# EAGLE design pad3 (EAGLE 6.5.0)
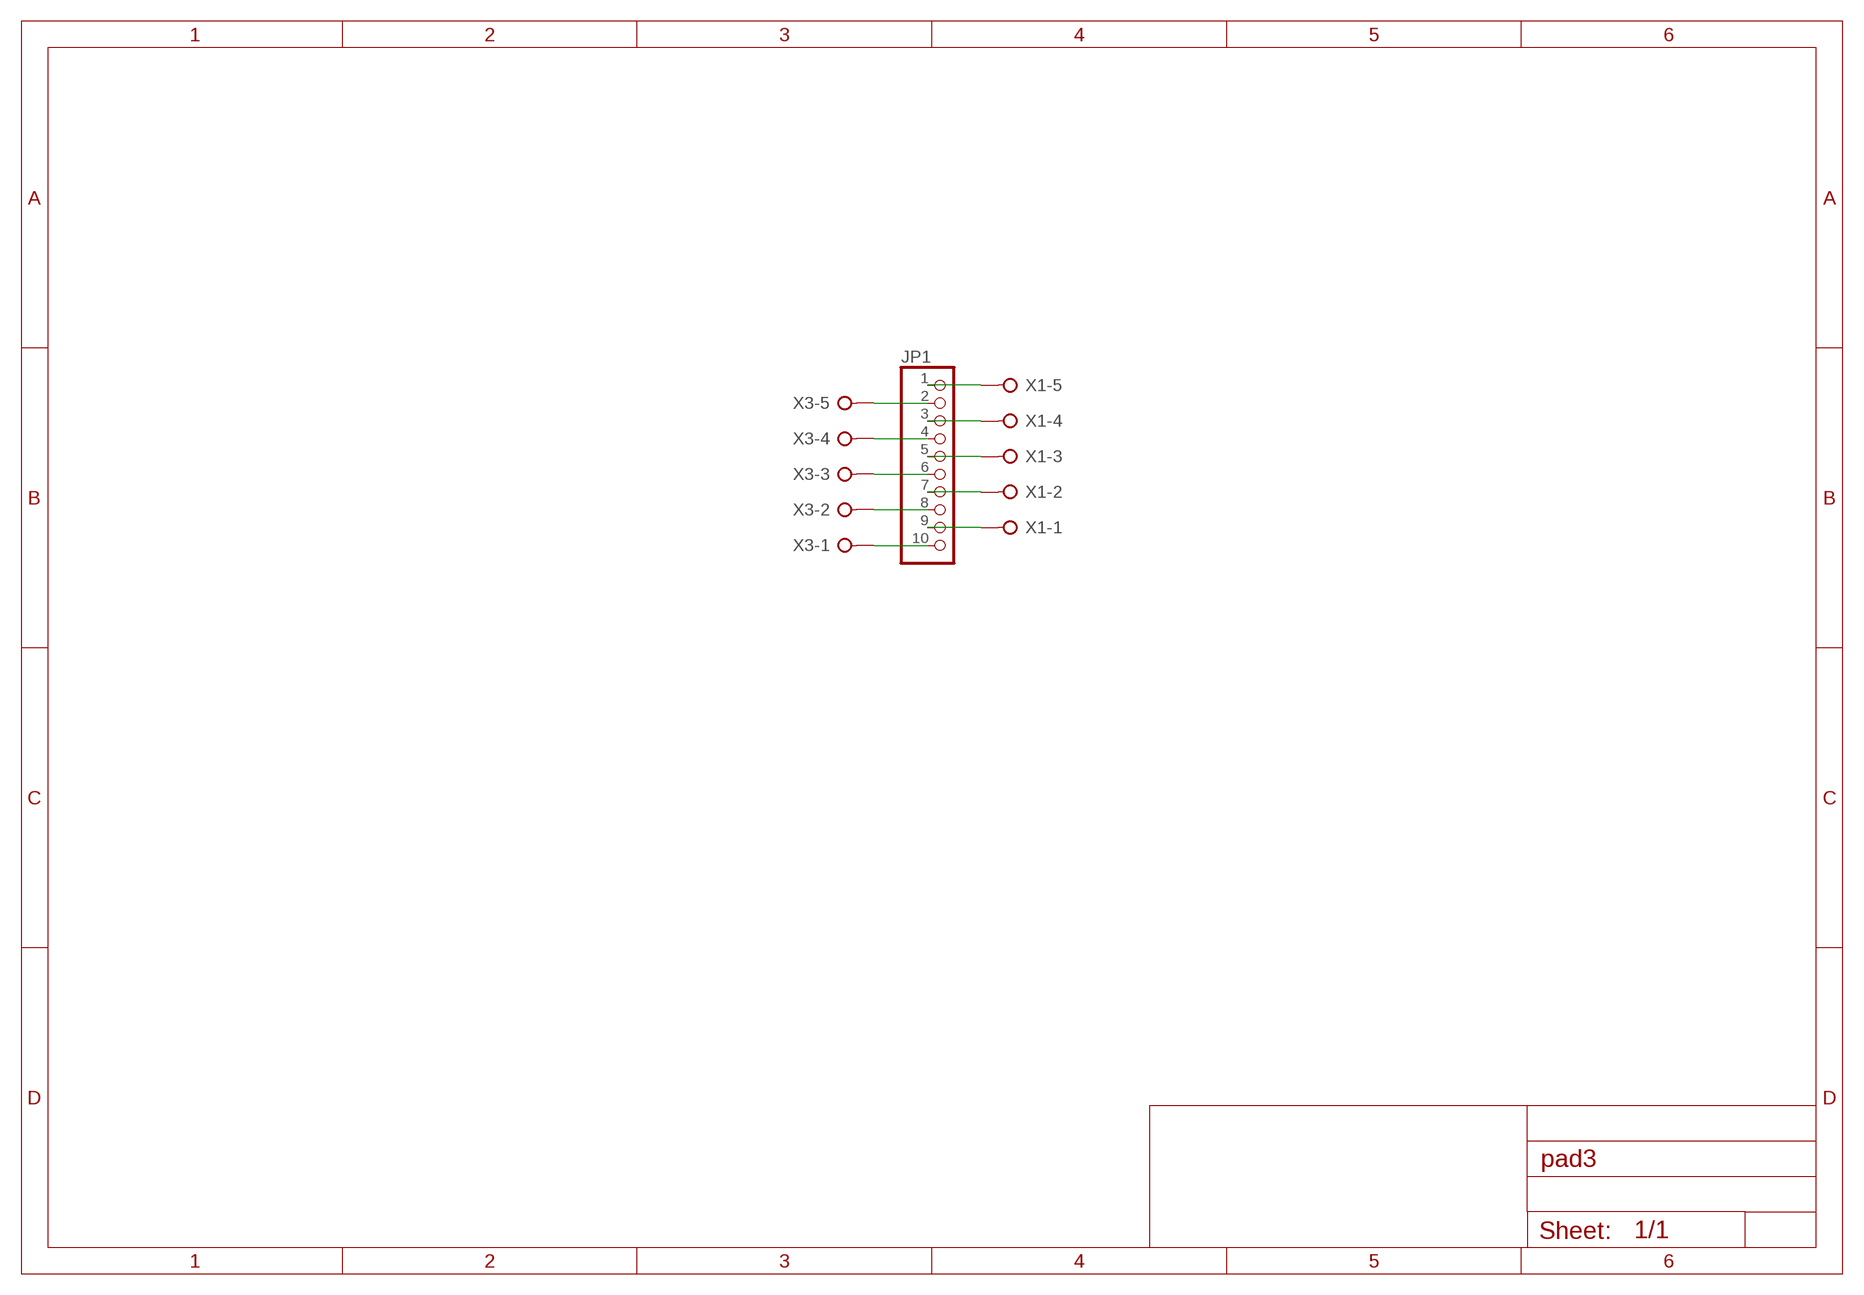
[diagram p0: schematic, sheet 1]

## Parts
JP1  PINHD-1X10  [1X10]
X1  W237-05P  [W237-5P]
X3  W237-05P  [W237-5P]

## Nets
N$1: JP1.9 X1.1
N$3: JP1.10 X3.1
N$5: JP1.8 X3.2
N$6: JP1.7 X1.2
N$7: JP1.6 X3.3
N$8: JP1.4 X3.4
N$9: JP1.5 X1.3
N$11: JP1.3 X1.4
N$12: JP1.2 X3.5
N$13: JP1.1 X1.5

## Library data of the parts
JP1 = pinhead:PINHD-1X10: PIN HEADER
X1 X3 = con-wago-508:W237-05P: WAGO SREW CLAMP; OC_FARNELL: unknown; OC_NEWARK: unknown

## Board
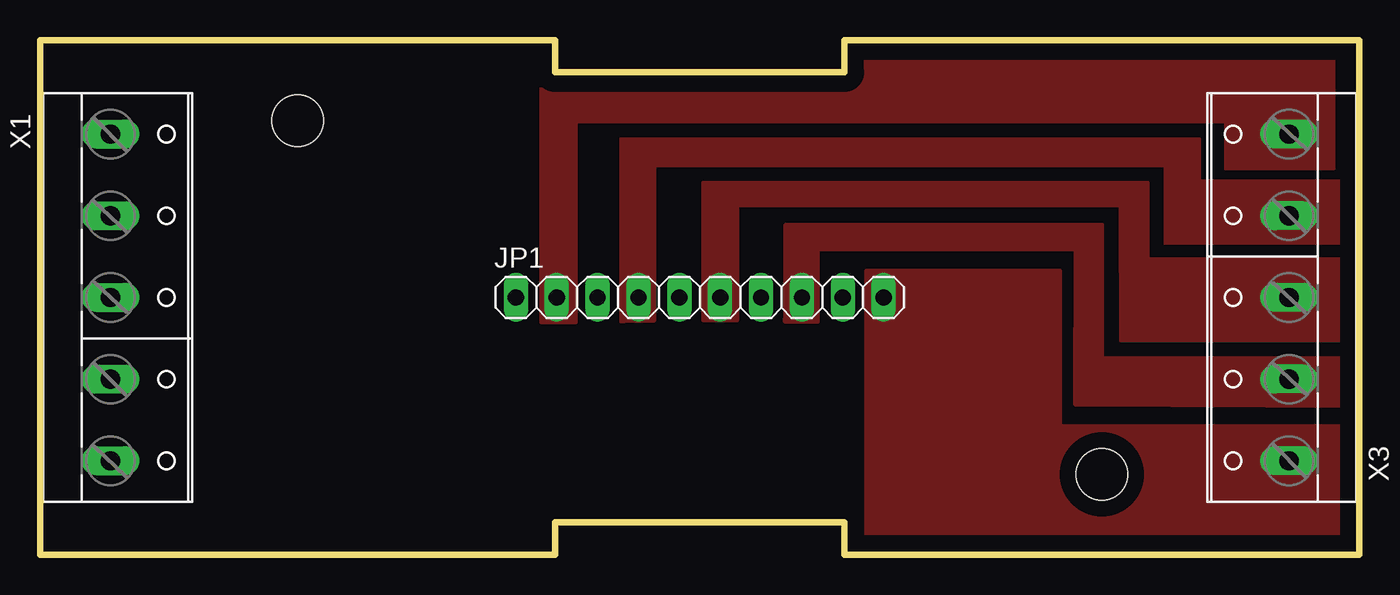
[diagram p1: board, top side]
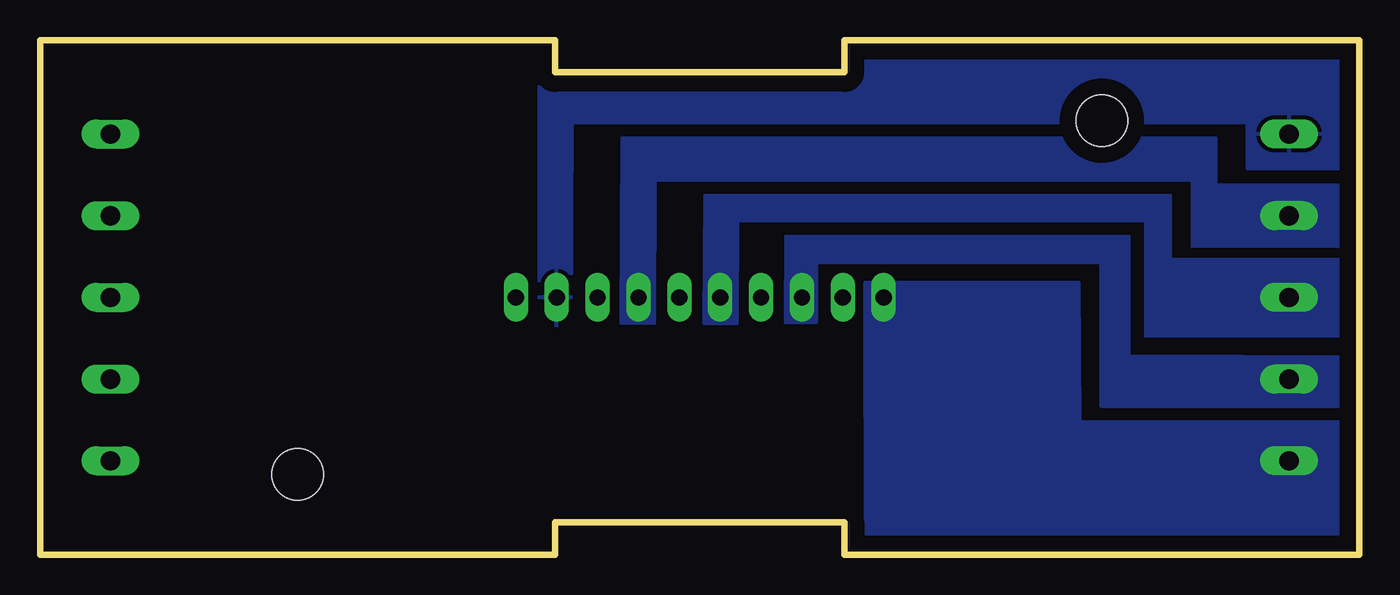
[diagram p2: board, bottom side, seen from below]

Size 82 x 32 mm. Coordinates in mm from the lower left corner, seen from the top.
Outline: 0,32 32,32 32,30 50,30 50,32 82,32 82,0 50,0 50,2 32,2 32,0 0,0 0,32
Copper layers (1*16): Top 0.035mm / dielectric 1.5mm / Bottom 0.035mm
Design rules "default": minimum track width 10mil, minimum drill 24mil, track to track 8mil, track to pad 8mil, pad to pad 8mil, via to via 8mil, smd to smd 8mil, copper to edge 40mil, drill to drill 8mil, minimum pad ring 10mil, minimum via ring 8mil, stop-mask expansion 4mil, vias tented up to drill 0mil, thermal gap 10mil
Holes 3.2 mm at 16,27 66,5

### Footprints (pad centres in the part's own frame; a part is rotated, then mirrored left to right if it is on the bottom)
1X10 = drill 1.016 long: 1 -11.43,0; 2 -8.89,0; 3 -6.35,0; 4 -3.81,0; 5 -1.27,0; 6 1.27,0; 7 3.81,0; 8 6.35,0; 9 8.89,0; 10 11.43,0
W237-5P = drill 1.194 long: 1 -10.16,-0.635; 2 -5.08,-0.635; 3 0,-0.635; 4 5.08,-0.635; 5 10.16,-0.635

### Placement (x,y rotation side)
JP1  41,16 0 top
X1  5,16 270 top
X3  77,16 90 top

### Tracks (layer width: path | path; a pad name or v marks a point on that pad's centre or on a via)
N$1
  pour Bottom: 0,32 51,32 51,14.3 49,14.3 48.95,26.9 6.95,26.9 6.95,24.04 0.06,24.01
N$3
  pour Top (no thermals): 51.38,17.68 63.38,17.68 63.38,8 82,8 82,-1 51.37,-1 51.37,17.68
N$5
  pour Top (no thermals): 46.34,14.59 46.34,20.53 66,20.53 66,12.24 82.15,12.24 82.12,9.21 64.36,9.32 64.38,18.97 48.33,18.97 48.33,14.49 46.31,14.49 46.31,14.69
N$6
  pour Bottom (no thermals): 0,22.96 8.91,22.96 8.92,25.89 45.82,25.89 45.9,14.43 43.8,14.43 43.79,23.3 10.37,23.34 10.38,19.22 -0.07,19.23
N$7
  pour Top (no thermals): 41.22,14.57 41.22,23.14 68.81,23.18 68.81,18.39 82.07,18.39 82.02,13.31 67.2,13.31 67.19,21.7 43.3,21.69 43.3,14.56
N$8
  pour Top (no thermals): 36.31,14.51 36.13,14.49 36.13,25.86 72.01,25.89 72.04,23.23 82.04,23.23 82.01,19.38 69.96,19.34 69.96,24.16 38.15,24.2 38.15,14.54
N$9
  pour Bottom (no thermals): 0.08,18.32 11.74,18.32 11.74,22.31 40.68,22.33 40.74,14.42 38.7,14.4 38.65,20.82 13.27,20.79 13.27,13.62 0.03,13.65
N$11
  pour Bottom (no thermals): 0.06,12.28 14.32,12.34 14.32,19.76 35.64,19.79 35.67,14.44 33.73,14.48 33.76,18.19 16.05,18.17 16.06,9.27 0.04,9.24
N$12
  pour Top (no thermals): 31,32 31.15,32 31.15,14.46 33.3,14.46 33.3,26.96 73.69,26.96 73.69,24.03 80.41,24.03 80.41,32.32 31.01,32.32 31.01,32.14
N$13
  pour Bottom (no thermals): 30.71,16.92 17.46,16.92 17.41,8.28 -0.03,8.25 -0.2,0.4 30.67,0.09